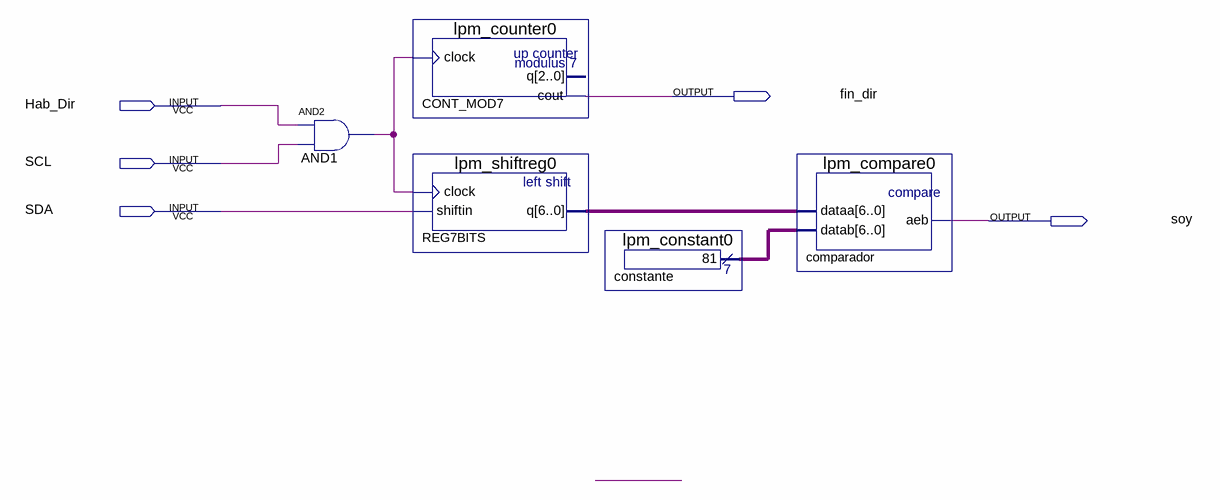
[diagram p0: schematic sheet]
// Quartus schematic bloque_a.bdf as structural Verilog: 5 symbols, 5 pins
module bloque_a (
  input  Hab_Dir,
  input  SCL,
  input  SDA,
  output fin_dir,
  output soy
);

  wire AND1_out;
  wire [6:0] constante_result, REG7BITS_q;

  and AND1 (AND1_out, Hab_Dir, SCL);
  lpm_counter0 CONT_MOD7 (.clock(AND1_out), .cout(fin_dir));  // open: q
  lpm_shiftreg0 REG7BITS (.clock(AND1_out), .shiftin(SDA), .q(REG7BITS_q));
  lpm_constant0 constante (.result(constante_result));
  lpm_compare0 comparador (.dataa(REG7BITS_q), .datab(constante_result), .aeb(soy));
endmodule
